# EAGLE design ISPACESLegacy2019 (EAGLE 9.2.2)
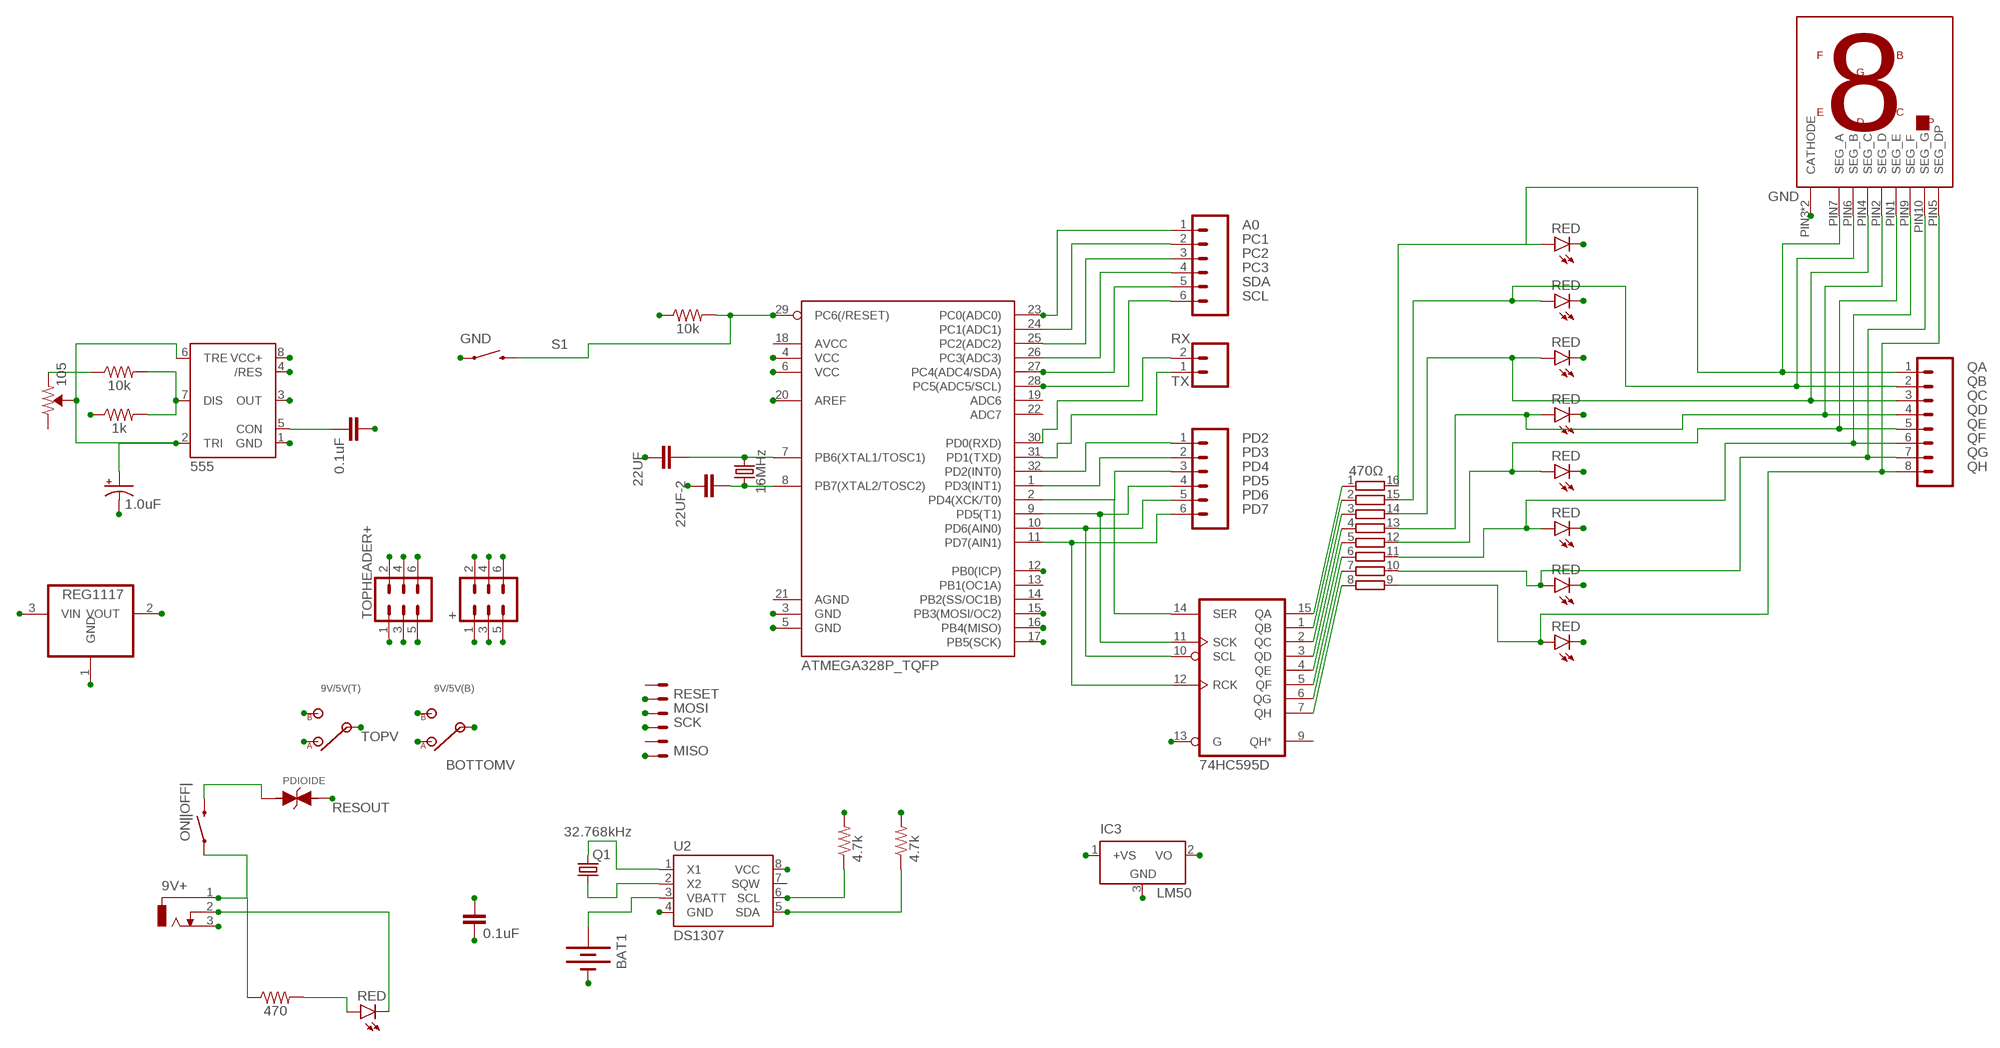
[diagram p0: schematic, sheet 1]

## Parts
9V+  DCJ0202  [DCJ0202]
9V/5V(B)  RES_SWITCH  [RES_SWITCH]
9V/5V(T)  RES_SWITCH  [RES_SWITCH]
22UF  22UF-1210-16V-20%  [1210]
22UF-2  22UF-1210-16V-20%  [1210]
470Ω  2NBS16-8  [SO16]
+  CONN_03X22X3_SILK_MALE_PTH  [2X3]
BAT1  BATTERY12PTH  [BATTCON_12MM_PTH]
C3  0.1uF  0.1UF-25V(+80/-20%)(0603)  [0603-CAP]
C4  0.1uF  0.1UF-0603-25V-(+80/-20%)  [0603]
C5  1.0uF  10UF-POLAR-EIA3216-16V-10%(TANT)  [EIA3216]
D1  RED  LED-RED1206  [LED-1206]
D2  RED  LED-RED1206  [LED-1206]
D3  RED  LED-RED1206  [LED-1206]
D4  RED  LED-RED1206  [LED-1206]
D5  RED  LED-RED1206  [LED-1206]
D6  RED  LED-RED1206  [LED-1206]
D7  RED  LED-RED1206  [LED-1206]
D8  RED  LED-RED1206  [LED-1206]
D10  RED  LED-RED1206  [LED-1206]
IC1  74HC595D  [SO16]
IC2  555  555D  [SO08]
IC3  LM50  [SOT23]
IC4  REG1117  [SOT223]
ISP  52745-0690  [52745-0690]
J1  CONN_08BM08B-SRSS-TB  [BM08B-SRSS-TB]
J2  CONN_02-JST-2MM-SMT  [JST-2-SMD]
J4  CONN_06SMD-FEMALE-V2  [1X06-SMD-FEMALE]
J5  CONN_06SMD-FEMALE-V2  [1X06-SMD-FEMALE]
ON||OFF|  RS032G05A3SM-SPST-MOMENTARY-SWSMD-1101NE  [TACTILE-SWITCH-1101NE]
PDIOIDE  WE-TVSP_BI_600W_824521201  [VARTVSP_SMB/DO-214AA]
Q1  32.768kHz  CRYSTAL32-SMD  [CRYSTAL-32KHZ-SMD]
R2  470  470OHM-0603-1/10W-1%  [0603]
R3  4.7k  4.7KOHM1/10W1%(0603)  [0603]
R4  4.7k  4.7KOHM1/10W1%(0603)  [0603]
R5  10k  10OHM-0603-1/10W-5%  [0603]
R6  1k  1KOHM-0603-1/10W-1%  [0603]
R7  10k  10OHM-0603-1/10W-1%  [0603]
S1  MOMENTARY-SWITCH-SPST-SMD-6.2MM-TALL  [TACTILE_SWITCH_SMD_6.2MM_TALL]
TOPHEADER+  CONN_03X22X3_SILK_MALE_PTH  [2X3]
U2  DS1307  DS1307SO8-TIGHT  [SO08-TIGHT]
U4  ATMEGA328P_TQFP  [TQFP32-08]
U$1  ACSC56SMT  [ACSC56]
VR1  105  TRIMPOT-SMD-3MM-CLOSED-1/8W-20%  [TRIMPOT-SMD-3MM-CLOSED]
Y1  16MHz  CRYSTAL-16MHZSMD-5X3.2  [CRYSTAL-SMD-5X3.2-4PAD]

## Nets
5V: 9V/5V(B).A 9V/5V(T).A C3.1 IC2.4(/RES) IC2.8(VCC+) IC3.1(+VS) IC4.2(VOUT) R3.2 R4.2 R5.1 R6.1 U2.8(VCC) U4.4(VCC) U4.6(VCC) U4.20(AREF)
A0: IC3.2(VO) J4.1 U4.23(PC0(ADC0))
BOTTOMV: 9V/5V(B).C(IN) +.2 +.4 +.6
GND: 9V+.2 9V+.3 22UF-2.2 22UF.2 +.1 +.3 +.5 BAT1.GND(-) C3.2 C4.1 C5.- D1.C D2.C D3.C D4.C D5.C D6.C D7.C D8.C D10.C IC1.13(G) IC2.1(GND) IC3.3(GND) IC4.1(GND) S1.A2 TOPHEADER+.1 TOPHEADER+.3 TOPHEADER+.5 U2.4(GND) U4.3(GND) U4.5(GND) U$1.PIN3(CATHODE) U$1.PIN8(CATHODE)
MISO: ISP.6 U4.16(PB4(MISO))
MOSI: ISP.3 U4.15(PB3(MOSI/OC2))
N$1: D10.A R2.2
N$2: 22UF.1 U4.7(PB6(XTAL1/TOSC1)) Y1.3
N$3: ON||OFF|.2 PDIOIDE.1
N$4: 22UF-2.1 U4.8(PB7(XTAL2/TOSC2)) Y1.1
N$5: IC2.7(DIS) R6.2 R7.2
N$6: C5.+ IC2.2(TRI) IC2.6(TRE) VR1.2(WIPER)
N$7: Q1.X2 U2.1(X1)
N$8: Q1.X1 U2.2(X2)
N$9: BAT1.VCC@1(+) U2.3(VBATT)
N$16: C4.2 IC2.5(CON)
N$17: 470Ω.1 IC1.15(QA)
N$18: 470Ω.2 IC1.1(QB)
N$19: 470Ω.3 IC1.2(QC)
N$20: 470Ω.4 IC1.3(QD)
N$21: 470Ω.5 IC1.4(QE)
N$22: 470Ω.6 IC1.5(QF)
N$23: 470Ω.7 IC1.6(QG)
N$24: 470Ω.8 IC1.7(QH)
N$39: R7.1 VR1.1(CCW)
PB0: IC2.3(OUT) U4.12(PB0(ICP))
PC1: J4.2 U4.24(PC1(ADC1))
PC2: J4.3 U4.25(PC2(ADC2))
PC3: J4.4 U4.26(PC3(ADC3))
PD2: J5.1 U4.32(PD2(INT0))
PD3: J5.2 U4.1(PD3(INT1))
PD4: IC1.14(SER) J5.3 U4.2(PD4(XCK/T0))
PD5: IC1.11(SCK) J5.4 U4.9(PD5(T1))
PD6: IC1.10(SCL) J5.5 U4.10(PD6(AIN0))
PD7: IC1.12(RCK) J5.6 U4.11(PD7(AIN1))
QA: 470Ω.16 D1.A J1.1 U$1.PIN7(SEG_A)
QB: 470Ω.15 D2.A J1.2 U$1.PIN6(SEG_B)
QC: 470Ω.14 D3.A J1.3 U$1.PIN4(SEG_C)
QD: 470Ω.13 D4.A J1.4 U$1.PIN2(SEG_D)
QE: 470Ω.12 D5.A J1.5 U$1.PIN1(SEG_E)
QF: 470Ω.11 D6.A J1.6 U$1.PIN9(SEG_F)
QG: 470Ω.10 D7.A J1.7 U$1.PIN10(SEG_G)
QH: 470Ω.9 D8.A J1.8 U$1.PIN5(SEG_DP)
RESET: ISP.2 R5.2 S1.B2 U4.29(PC6(/RESET))
RESOUT: 9V/5V(B).B 9V/5V(T).B IC4.3(VIN) PDIOIDE.2
RX: J2.2 U4.30(PD0(RXD))
SCK: ISP.4 U4.17(PB5(SCK))
SCL: J4.6 R3.1 U2.6(SCL) U4.28(PC5(ADC5/SCL))
SDA: J4.5 R4.1 U2.5(SDA) U4.27(PC4(ADC4/SDA))
TOPV: 9V/5V(T).C(IN) TOPHEADER+.2 TOPHEADER+.4 TOPHEADER+.6
TX: J2.1 U4.31(PD1(TXD))
UNRESOUT: 9V+.1 ON||OFF|.1 R2.1
Unconnected: IC1.9(QH*) ISP.1 ISP.5 U2.7(SQW) U4.13(PB1(OC1A)) U4.14(PB2(SS/OC1B)) U4.18(AVCC) U4.19(ADC6) U4.21(AGND) U4.22(ADC7) VR1.3(CW)

## Power pins joined to a net without a drawn wire
GND: IC1.8(GND)
VCC: IC1.16(VCC)

## Library data of the parts
9V+ = con-jack:DCJ0202: DC POWER JACK Source: DCJ0202.pdf; OC_FARNELL: unknown; OC_NEWARK: unknown
9V/5V(B) 9V/5V(T) = switches:RES_SWITCH: 0402 Static Resistor Selector
22UF 22UF-2 = SparkFun-Capacitors:22UF: 22µF ceramic capacitors A capacitor is a passive two-terminal electrical component used to store electrical energy temporarily in an electric field.
470Ω = resistor-bourns:2NBS16-8: BOURNS RESISTOR NETWORK; OC_FARNELL: unknown; OC_NEWARK: unknown
+ TOPHEADER+ = SparkFun-Connectors:CONN_03X2: Multi connection point. Often used as Generic Header-pin footprint for 0.1 inch spaced/style header connections You can populate with any combo of single row headers, but if you'd like an exact match, check these: Header - 2x3 (Male, 0.1") <https://www.sparkfun.com/products/12807> (PRT-12807) Header - 2x3 (Female, 0.1") <https://www.sparkfun.com/products/13010> (PRT-13010) 2x3 Pin Shrouded Header <https://www.sparkfun.com/products/10877> (PRT-10877) On any of the 0.1 inch spaced packages, you can populate with these: Break Away Headers - Straight <https://www.sparkfun.com/products/116> (PRT-00116) Break Away Male Headers - Right Angle <https://www.sparkfun.com/products/553> (PRT-00553) Female Headers <https://www.sparkfun.com/products/115> (PRT-00115) Break Away Headers - Machine Pin <https://www.sparkfun.com/products/117> (PRT-00117) Break Away Female Headers - Swiss Machine Pin <https://www.sparkfun.com/products/743> (PRT-00743) Special note: the shrouded connector mates well with our 3x2 ribbon cables: Ribbon Crimp Connector - 6-pin (2x3, Female) <https://www.sparkfun.com/products/10651> (PRT-10651) Ribbon Cable - 6 wire (15ft) <https://www.sparkfun.com/products/10646> (PRT-10646); PROD_ID: CONN-09701
BAT1 = SparkFun-Electromechanical:BATTERY: Battery Holders Various common sizes : AA, AAA, 20mm coin cell and 12mm coin cell. 20MM_4LEGS, BATT-10373
C3 = SparkFun-Capacitors:0.1UF-25V(+80/-20%)(0603): CAP-00810 Ceramic Standard decoupling cap; PROD_ID: CAP-00810
C4 = SparkFun-Capacitors:0.1UF: 0.1µF ceramic capacitors A capacitor is a passive two-terminal electrical component used to store electrical energy temporarily in an electric field.; PROD_ID: CAP-00810
C5 = SparkFun-Capacitors:10UF-POLAR: 10.0µF polarized capacitors A capacitor is a passive two-terminal electrical component used to store electrical energy temporarily in an electric field.; PROD_ID: CAP-00811; VALUE: 10uF
D1-D8 D10 = SparkFun-LED:LED-RED: Red SMD LED Used in manufacturing of most products at SparkFun Packages: 0603 - SMD 0603 package [Product Link] <http://docs.avagotech.com/docs/AV02-0551EN> 0603 SMART - SMD 0603 SMART package ( more efficient and expensive)[Product Link] <http://www.osram-os.com/Graphics/XPic2/00077099_0.pdf> 1206 - SMD1206 package [Product Link] <https://www.sparkfun.com/datasheets/DevTools/LilyPad/Q150OVS4.pdff> SparkFun Products: Pro Mini 328 -5V <https://www.sparkfun.com/products/821> RedBoard <https://www.sparkfun.com/products/12757> IOIO-OTG <https://www.sparkfun.com/products/13613>; PROD_ID: DIO-09912
IC1 = 74xx-eu:74*595: 8-bit SHIFT REGISTER, output latch
IC2 = SparkFun-IC-Special-Function:555: General purpose bipolar Timer Datasheet <http://www.sparkfun.com/datasheets/Components/General/ne555.pdf> SparkFun Products SparkFun SparkPunk Sequencer Kit <https://www.sparkfun.com/products/12707> (KIT-12707) Storefront Component: 555 Timer <https://www.sparkfun.com/products/9273> (COM-09273) Two parts valid for production: VFP: IC-11930 (M7555 PTH) VFP: IC-09173 (555 PTH) - Preferred; PROD_ID: NA-XXXXX
IC3 = linear:LM50: SOT-23 Single-Supply Centigrade Temperature Sensor Vout = (10mV/°C x Temp °C) +5mmmV Source: http://cache.national.com/ds/LM/LM50.pdf
IC4 = burr-brown:REG1117: 800mA and 1A Low Dropout (LDO) Positive Regulator 1.8V, 2.5V, 2.85V, 3.3V, 5V, and Adj; MPN: REG1117; OC_FARNELL: 1097566; OC_NEWARK: 14P6981
ISP = con-molex:52745-0690: FFC/FPC-to-Board 0.50mm (.020") SMT Top Contact Right Angle, ZIF, Style Receptacle 52745 / 52435 Source: http://www.molex.com/product/ffc/52745.html; MF: MOLEX; MPN: 52745-0690; OC_FARNELL: unknown; OC_NEWARK: 92M6374
J1 = SparkFun-Connectors:CONN_08: Multi connection point. Often used as Generic Header-pin footprint for 0.1 inch spaced/style header connections On any of the 0.1 inch spaced packages, you can populate with these: Break Away Headers - Straight <https://www.sparkfun.com/products/116> (PRT-00116) Break Away Male Headers - Right Angle <https://www.sparkfun.com/products/553> (PRT-00553) Female Headers <https://www.sparkfun.com/products/115> (PRT-00115) Break Away Headers - Machine Pin <https://www.sparkfun.com/products/117> (PRT-00117) Break Away Female Headers - Swiss Machine Pin <https://www.sparkfun.com/products/743> (PRT-00743) Arduino Stackable Header - 8 Pin <https://www.sparkfun.com/products/9279> (PRT-09279) For SCREWTERMINALS and SPRING TERMINALS visit here: Screw Terimnals on SparkFun.com <https://www.sparkfun.com/search/results?term=Screw+Terminals> (5mm/3.5mm/2.54mm spacing) This device is also useful as a general connection point to wire up your design to another part of your project. Our various solder wires solder well into these plated through hole pads. Hook-Up Wire - Assortment (Stranded, 22 AWG) <https://www.sparkfun.com/products/11375> (PRT-11375) Hook-Up Wire - Assortment (Solid Core, 22 AWG) <https://www.sparkfun.com/products/11367> (PRT-11367) View the entire wire category on our website here <https://www.sparkfun.com/categories/141> Special notes: Molex polarized connector foot print use with SKU : PRT-08231 with associated crimp pins and housings. 1MM SMD Version SKU: PRT-10208 NOTES ON THE VARIANTS LOCK and LOCK_LONGPADS... This footprint was designed to help hold the alignment of a through-hole component (i.e. 6-pin header) while soldering it into place. You may notice that each hole has been shifted either up or down by 0.005 of an inch from it's more standard position (which is a perfectly straight line). This slight alteration caused the pins (the squares in the middle) to touch the edges of the holes. Because they are alternating, it causes a "brace" to hold the component in place. 0.005 has proven to be the perfect amount of "off-center" position when using our standard breakaway headers. Although looks a little odd when you look at the bare footprint, once you have a header in there, the alteration is very hard to notice. Also,if you push a header all the way into place, it is covered up entirely on the bottom side.; PROD_ID: CONN-10556
J2 = SparkFun-Connectors:CONN_02: Multi connection point. Often used as Generic Header-pin footprint for 0.1 inch spaced/style header connections On any of the 0.1 inch spaced packages, you can populate with these: Break Away Headers - Straight <https://www.sparkfun.com/products/116> (PRT-00116) Break Away Male Headers - Right Angle <https://www.sparkfun.com/products/553> (PRT-00553) Female Headers <https://www.sparkfun.com/products/115> (PRT-00115) Break Away Headers - Machine Pin <https://www.sparkfun.com/products/117> (PRT-00117) Break Away Female Headers - Swiss Machine Pin <https://www.sparkfun.com/products/743> (PRT-00743) For SCREWTERMINALS and SPRING TERMINALS visit here: Screw Terimnals on SparkFun.com <https://www.sparkfun.com/search/results?term=Screw+Terminals> (5mm/3.5mm/2.54mm spacing) This device is also useful as a general connection point to wire up your design to another part of your project. Our various solder wires solder well into these plated through hole pads. Hook-Up Wire - Assortment (Stranded, 22 AWG) <https://www.sparkfun.com/products/11375> (PRT-11375) Hook-Up Wire - Assortment (Solid Core, 22 AWG) <https://www.sparkfun.com/products/11367> (PRT-11367) View the entire wire category on our website here <https://www.sparkfun.com/categories/141> Special notes: Molex polarized connector foot print use with: PRT-08233 with associated crimp pins and housings. 2.54_SCREWTERM for use with PRT-10571. 3.5mm Screw Terminal footprints for PRT-08084 5mm Screw Terminal footprints for use with PRT-08432; PROD_ID: CONN-11443
J4 J5 = SparkFun-Connectors:CONN_06: Multi connection point. Often used as Generic Header-pin footprint for 0.1 inch spaced/style header connections On any of the 0.1 inch spaced packages, you can populate with these: Break Away Headers - Straight <https://www.sparkfun.com/products/116> (PRT-00116) Break Away Male Headers - Right Angle <https://www.sparkfun.com/products/553> (PRT-00553) Female Headers <https://www.sparkfun.com/products/115> (PRT-00115) Break Away Headers - Machine Pin <https://www.sparkfun.com/products/117> (PRT-00117) Break Away Female Headers - Swiss Machine Pin <https://www.sparkfun.com/products/743> (PRT-00743) Arduino Stackable Header - 6 Pin <https://www.sparkfun.com/products/9280> (PRT-09280) For SCREWTERMINALS and SPRING TERMINALS visit here: Screw Terimnals on SparkFun.com <https://www.sparkfun.com/search/results?term=Screw+Terminals> (5mm/3.5mm/2.54mm spacing) This device is also useful as a general connection point to wire up your design to another part of your project. Our various solder wires solder well into these plated through hole pads. Hook-Up Wire - Assortment (Stranded, 22 AWG) <https://www.sparkfun.com/products/11375> (PRT-11375) Hook-Up Wire - Assortment (Solid Core, 22 AWG) <https://www.sparkfun.com/products/11367> (PRT-11367) View the entire wire category on our website here <https://www.sparkfun.com/categories/141>; PROD_ID: CONN-09668
ON||OFF| = BeagleBone_Blue_R3:RS032G05A3SM-SPST-MOMENTARY-SW: 6x3.5mm 2-pin Momentary Switch (Push-button) Digikey Link <https://www.digikey.com/products/en?keywords=CKN10388TR-ND> Datasheet <https://media.digikey.com/pdf/Data%20Sheets/C&K/RS-032G05_-SM_RT.pdf>; PROD_ID: SWCH-00815
PDIOIDE = Wurth_Elektronik_Passive_rev18f:WE-TVSP_BI_600W: WE-TVSP Power TVS Diode <http://katalog.we-online.de/media/images/v2/WE-TVSP_600W-3000W_D0214AA_4C.jpg> Details see: http://katalog.we-online.de/en/pbs/WE-TVSP/824500101 2015 (C) Würth Elektronik
Q1 = SparkFun-FreqCtrl:CRYSTAL: Various standard crystals. Proven footprints. Spark Fun Electronics SKU : COM-00534
R2 = SparkFun-Resistors:470OHM: 470Ω resistor A resistor is a passive two-terminal electrical component that implements electrical resistance as a circuit element. Resistors act to reduce current flow, and, at the same time, act to lower voltage levels within circuits. - Wikipedia; PROD_ID: RES-07869
R3 R4 = SparkFun-Resistors:4.7KOHM1/10W1%(0603): RES-07857; PROD_ID: RES-07857
R5 = SparkFun-Resistors:10OHM: 10Ω resistor A resistor is a passive two-terminal electrical component that implements electrical resistance as a circuit element. Resistors act to reduce current flow, and, at the same time, act to lower voltage levels within circuits. - Wikipedia; PROD_ID: RES-09834; VALUE: 10
R6 = SparkFun-Resistors:1KOHM: 1kΩ resistor A resistor is a passive two-terminal electrical component that implements electrical resistance as a circuit element. Resistors act to reduce current flow, and, at the same time, act to lower voltage levels within circuits. - Wikipedia; PROD_ID: RES-07856
R7 = SparkFun-Resistors:10OHM: 10Ω resistor A resistor is a passive two-terminal electrical component that implements electrical resistance as a circuit element. Resistors act to reduce current flow, and, at the same time, act to lower voltage levels within circuits. - Wikipedia; PROD_ID: RES-12581; VALUE: 10
S1 = SparkFun-Switches:MOMENTARY-SWITCH-SPST: Momentary Switch (Pushbutton) - SPST Normally-open (NO) SPST momentary switches (buttons, pushbuttons). Variants PTH-12MM - 12mm square, through-hole Momentary Pushbutton Switch - 12mm Square <https://www.sparkfun.com/products/9190> (COM-09190) PTH-6.0MM, PTH-6.0MM-KIT - 6.0mm square, through-hole Mini Pushbutton Switch <https://www.sparkfun.com/products/97> (COM-00097) KIT package intended for soldering kit's - only one side of pads' copper is exposed. PTH-RIGHT-ANGLE-KIT - Right-angle, through-hole Right Angle Tactile Button <https://www.sparkfun.com/products/10791> - Used on SparkFun BigTime Watch Kit <https://www.sparkfun.com/products/11734> SMD-12MM - 12mm square, surface-mount Tactile Button - SMD (12mm) <https://www.sparkfun.com/products/12993> (COM-12993) Used on SparkFun PicoBoard <https://www.sparkfun.com/products/11888> SMD-4.5MM - 4.5mm Square Trackball Switch Used on SparkFun Blackberry Trackballer Breakout <https://www.sparkfun.com/products/13169> SMD-4.6MMX2.8MM - 4.60mm x 2.80mm, surface mount Used on SparkFun SAMD21 Mini Breakout <https://www.sparkfun.com/products/13664> SMD-5.2MM, SMD-5.2-REDUNDANT - 5.2mm square, surface-mount Mini Pushbutton Switch - SMD <https://www.sparkfun.com/products/8720> (COM-08720) Used on Arduino Pro Mini <https://www.sparkfun.com/products/11114> REDUNDANT package connects both switch circuits together SMD-6.0X3.5MM - 6.0 x 3.5mm, surface mount Momentary Reset Switch SMD <https://www.sparkfun.com/products/8229> (COM-08229) SMD-6.2MM-TALL - 6.2mm square, surface mount Tactile Button - SMD (6mm) <https://www.sparkfun.com/products/12992> Used on SparkFun Digital Sandbox <https://www.sparkfun.com/products/12651> SMD-RIGHT-ANGLE - Right-angle, surface mount Used on SparkFun Block for Intel® Edison - Arduino <https://www.sparkfun.com/products/13036>; PROD_ID: SWCH-11966; SF_SKU: COM-12992
U2 = SparkFun-FreqCtrl:DS1307: I2C real-time clock with battery backup.
U4 = SparkFun-IC-Microcontroller:ATMEGA328P_TQFP: Popular 328P in QFP Storefront component: ATmega328 - TQFP <https://www.sparkfun.com/products/13448> (COM-13448) Datasheet <http://www.sparkfun.com/datasheets/Components/SMD/ATMega328.pdf> SparkFun Products SparkFun RedBoard - Programmed with Arduino <https://www.sparkfun.com/products/12757> (DEV-12757) Arduino Pro Mini 328 - 5V/16MHz <https://www.sparkfun.com/products/11113> (DEV-11113) Arduino Pro Mini 328 - 3.3V/8MHz <https://www.sparkfun.com/products/11114> (DEV-11114) SparkFun OpenLog <https://www.sparkfun.com/products/13712> (DEV-13712) SparkFun MicroView - OLED Arduino Module <https://www.sparkfun.com/products/12923> (DEV-12923) SparkFun Digital Sandbox <https://www.sparkfun.com/products/12651> (DEV-12651) SparkFun PicoBoard <https://www.sparkfun.com/products/11888> (WIG-11888) Arduino Fio <https://www.sparkfun.com/products/10116> (DEV-10116) LilyPad Arduino 328 Main Board <https://www.sparkfun.com/products/13342> (DEV-13342) SparkFun RedStick <https://www.sparkfun.com/products/13741> (DEV-13741) LilyPad MP3 <https://www.sparkfun.com/products/11013> (DEV-11013) LilyPad Arduino SimpleSnap <https://www.sparkfun.com/products/10941> (DEV-10941) SparkFun Stepoko <https://www.sparkfun.com/products/13899> (ROB-13899) SparkFun Geiger Counter <https://www.sparkfun.com/products/11345> (SEN-11345) SparkFun EL Sequencer <https://www.sparkfun.com/products/12781> (COM-12781) Arduino Pro 328 - 5V/16MHz <https://www.sparkfun.com/products/10915> (DEV-10915) CryptoCape <https://www.sparkfun.com/products/12773> (DEV-12773) SparkFun IR Thermometer Evaluation Board - MLX90614 <https://www.sparkfun.com/products/10740> (SEN-10740) SparkFun RedBot Mainboard <https://www.sparkfun.com/products/12097> (ROB-12097) Arduino Pro 328 - 3.3V/8MHz <https://www.sparkfun.com/products/10914> (DEV-10914) SparkFun Block for Intel® Edison - Arduino <https://www.sparkfun.com/products/13036> (DEV-13036) SparkFun Simon Says - Surface Mount Soldering Kit <https://www.sparkfun.com/products/10935> (KIT-10935) SparkFun 7-Segment Serial Display - Red <https://www.sparkfun.com/products/11441> (COM-11441) SparkFun 7-Segment Serial Display - White <https://www.sparkfun.com/products/11629> (COM-11629) SparkFun 7-Segment Serial Display - Yellow <https://www.sparkfun.com/products/11443> (COM-11443) SparkFun 7-Segment Serial Display - Kelly Green <https://www.sparkfun.com/products/11440> (COM-11440) SparkFun 7-Segment Serial Display - Blue <https://www.sparkfun.com/products/11442> (COM-11442) SparkFun OpenSegment Serial Display - 20mm (Blue) <https://www.sparkfun.com/products/11647> (COM-11647) SparkFun OpenSegment Serial Display - 20mm (Green) <https://www.sparkfun.com/products/11646> (COM-11646) SparkFun OpenSegment Serial Display - 20mm (White) <https://www.sparkfun.com/products/11648> (COM-11648) SparkFun OpenSegment Serial Display - 20mm (Red) <https://www.sparkfun.com/products/11644> (COM-11644) SparkFun OpenSegment Serial Display - 20mm (Yellow) <https://www.sparkfun.com/products/11645> (COM-11645) SparkFun OpenSegment Shield <https://www.sparkfun.com/products/13190> (DEV-13190); PROD_ID: IC-09069
U$1 = Feesta-parts:ACSC56
VR1 = SparkFun-Resistors:TRIMPOT: Trimming Potentiometer (Trimpot) Three-terminal potentiometers, with an adjustable wiper and two adjustable resistors. A pot can be used to create a configurable voltage divider, or as a variable resistor. "Trimpots" are a subset of potentiometers, usually intended for "set-and-forget" applications. They're often more delicate than standard potentiometers - rated for fewer turns. Variants PTH-KNOB - PTH Trimpot w/ finger-adjustable knob Trimpot 10K with Knob <https://www.sparkfun.com/products/9806> (COM-09806) Datasheet <http://www.sparkfun.com/datasheets/Components/General/TSR-3386.pdf> SMD-3MM-CLOSED-FRAME - SMD 3mm Square Closed-Frame Trimpot Used on e.g. EasyDriver - Stepper Motor Driver <https://www.sparkfun.com/products/12779> Datasheet <http://www.bitechnologies.com/pdfs/22.pdf> (22AR10KTR) SMD-5MM - SMD 5mm Square Closed-Frame Trimpot Used on e.g. IOIO-OTG - V2.2 <https://www.sparkfun.com/products/13613> Datasheet <http://www.vishay.com/docs/51008/ts53.pdf> (TS53YL502MR10) SMD-3MM-1/10W-25% - 3mm Square Open-Frame Trimpot Used on e.g. SparkFun Shapeoko <https://www.sparkfun.com/products/13899> Datasheet <http://www.bourns.com/docs/Product-Datasheets/TC33.pdf> (TC33X-2-103E); PROD_ID: RES-09285; VALUE: 10k
Y1 = SparkFun-Clocks:CRYSTAL-16MHZ: 16MHz Crystal Digikey Example <http://www.digikey.com/product-search/en?keywords=535-9122-1-ND> Frequency: 16MHz Frequency Stability: ±50ppm Frequency Tolerance: ±20ppm Load Capacitance: 18pF SparkFun Products: Pro Micro -5V/16MHz <https://www.sparkfun.com/products/12640> SparkFun Serial Enabled LCD Kit <https://www.sparkfun.com/products/10097>; PROD_ID: XTAL-08218; SF_ID: COM-00094

## Board
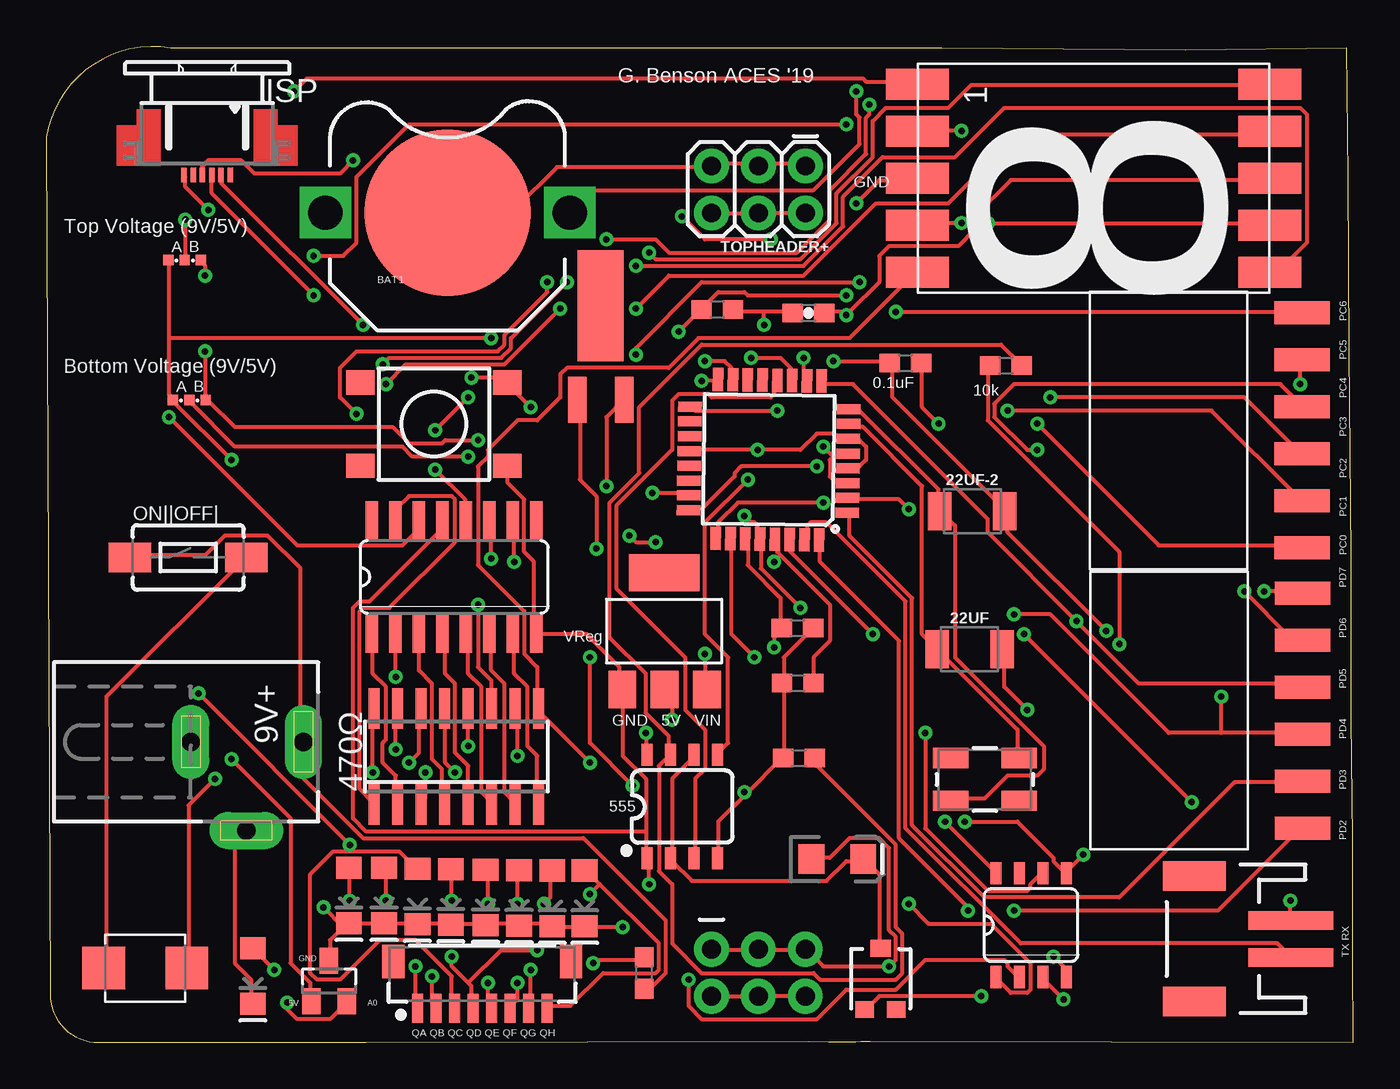
[diagram p1: board, top side]
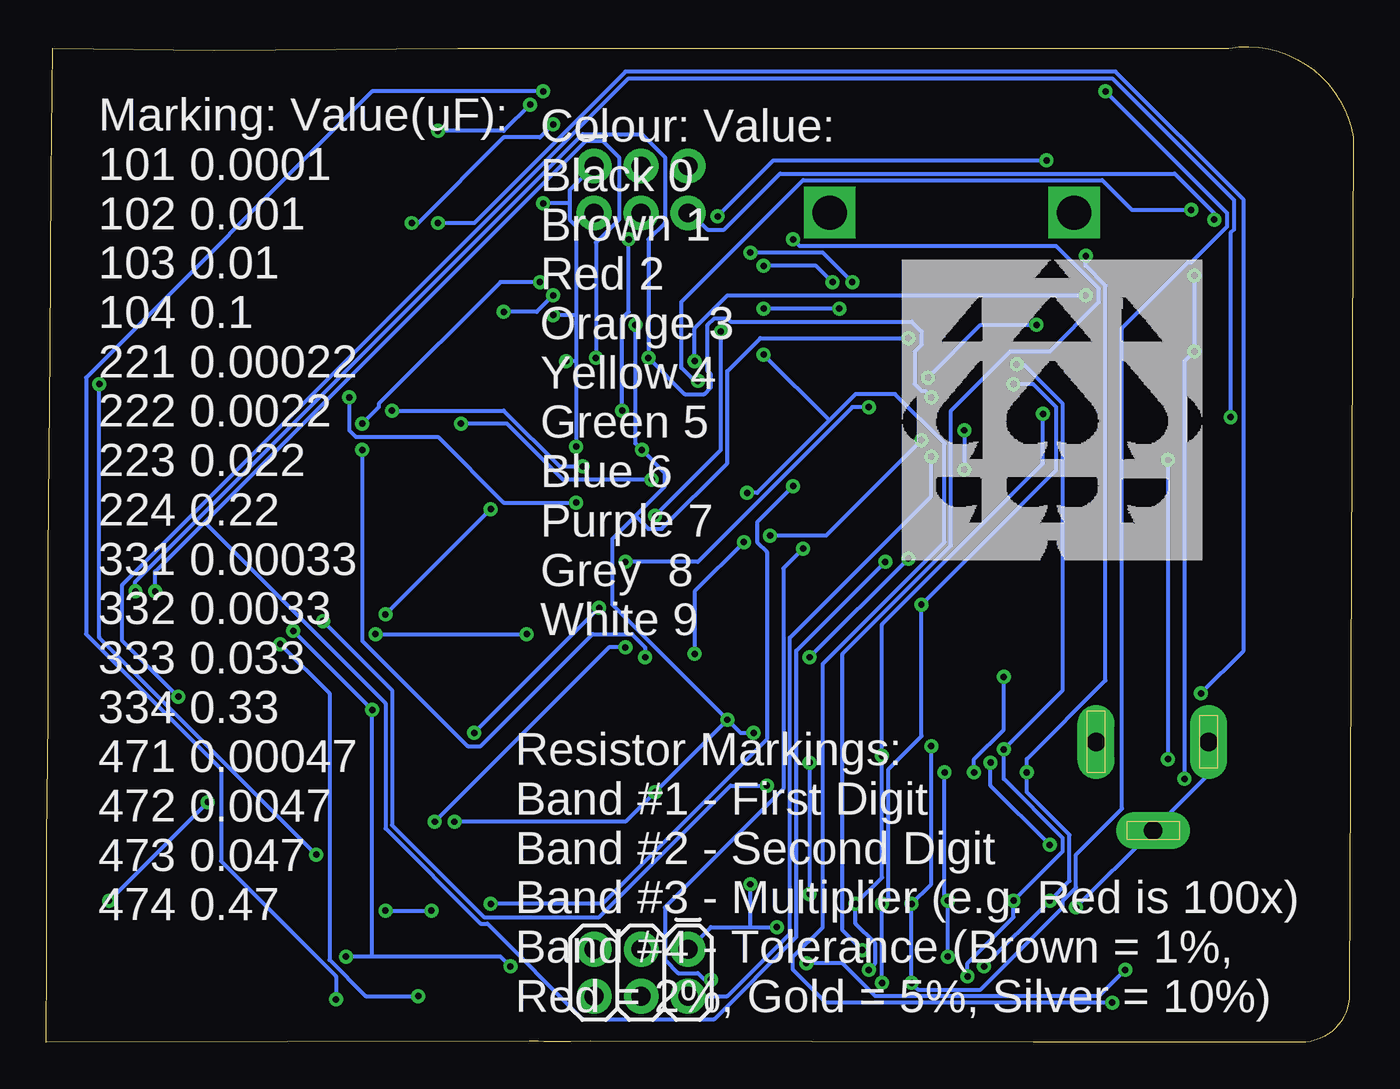
[diagram p2: board, bottom side, seen from below]

Size 70.66 x 53.82 mm. Coordinates in mm from the lower left corner, seen from the top.
Outline: 44.07,0.06 44.19,0.06 44.21,0.06 44.25,0.06 44.3,0.06 44.39,0.06 44.51,0.06 44.54,0.06 44.55,0.06 44.56,0.06 70.66,0.02 70.63,4.49 70.63,10.98 70.56,17.5 70.56,26.34 70.46,37.33 70.39,46.76 70.33,53.74 61.58,53.63 48.41,53.74 6.73,53.74 arc90 0,48.91 0.21,2.61 arc90 2.83,0 14.22,0 14.84,0.01 15.49,0.01 17.31,0.01 41.23,0.06 42.32,0.05 43.79,0.05 44.05,0.05 44.07,0.06
Copper layers (1*16): Top 0.035mm / dielectric 1.5mm / Bottom 0.035mm
Design rules "default *": minimum track width 8mil, minimum drill 0.35mm, track to track 6mil, track to pad 6mil, pad to pad 6mil, via to via 6mil, smd to smd 6mil, copper to edge 40mil, drill to drill 6mil, minimum pad ring 10mil, minimum via ring 8mil, stop-mask expansion 4mil, vias tented up to drill 0mil, thermal gap 10mil

### Footprints (pad centres in the part's own frame; a part is rotated, then mirrored left to right if it is on the bottom)
DCJ0202 = drill 1 pad 2 long: 1 0,3.1; 2 4.8,0; 3 0,-3
RES_SWITCH = smd 0.56 x 0.56: A -0.88,0; B 0.88,0; C 0,0
1210 = smd 1.27 x 2.06: 1 -1.755,0; 2 1.755,0
SO16 = smd 0.6 x 2.2: 1 -4.445,-2.6; 2 -3.175,-2.6; 3 -1.905,-2.6; 4 -0.635,-2.6; 5 0.635,-2.6; 6 1.905,-2.6; 7 3.175,-2.6; 8 4.445,-2.6; 9 4.445,2.6; 10 3.175,2.6; 11 1.905,2.6; 12 0.635,2.6; 13 -0.635,2.6; 14 -1.905,2.6; 15 -3.175,2.6; 16 -4.445,2.6
2X3 = drill 1.016 pad 1.88: 1 0,0; 2 0,2.54; 3 2.54,0; 4 2.54,2.54; 5 5.08,0; 6 5.08,2.54
BATTCON_12MM_PTH = smd 9 x 9: GND 0,0 | drill 1.854 square: VCC@1 6.604,0; VCC@2 -6.604,0
0603-CAP = smd 1.1 x 1: 1 -0.85,0; 2 0.85,0
0603 = smd 1.1 x 1: 1 -0.85,0; 2 0.85,0
EIA3216 = smd 1.4 x 1.6: + 1.4,0; - -1.4,0
LED-1206 = smd 1.2 x 1.4: A -1.5,0; C 1.5,0
SO16' = smd 0.66 x 2.032: 1 -4.445,-3.073; 2 -3.175,-3.073; 3 -1.905,-3.073; 4 -0.635,-3.073; 5 0.635,-3.073; 6 1.905,-3.073; 7 3.175,-3.073; 8 4.445,-3.073; 9 4.445,3.073; 10 3.175,3.073; 11 1.905,3.073; 12 0.635,3.073; 13 -0.635,3.073; 14 -1.905,3.073; 15 -3.175,3.073; 16 -4.445,3.073
SO08 = smd 0.6 x 1.2: 1 -1.905,-2.8; 2 -0.635,-2.8; 3 0.635,-2.8; 4 1.905,-2.8; 5 1.905,2.8; 6 0.635,2.8; 7 -0.635,2.8; 8 -1.905,2.8
SOT23 = smd 1 x 1.4: 1 -0.95,-1.1; 2 0.95,-1.1; 3 0,1.1
SOT223 = smd 1.499 x 2.007: 1 -2.261,-3.15; 2 0.025,-3.15; 3 2.311,-3.15 | smd 3.81 x 2.007: 4 0,3.15
52745-0690 = smd 0.3 x 0.8: 1 -1.25,2.5; 2 -0.75,2.5; 3 -0.25,2.5; 4 0.25,2.5; 5 0.75,2.5; 6 1.25,2.5
BM08B-SRSS-TB = smd 0.6 x 1.55: 1 -3.5,0; 2 -2.5,0; 3 -1.5,0; 4 -0.5,0; 5 0.5,0; 6 1.5,0; 7 2.5,0; 8 3.5,0 | smd 1.2 x 1.8: P$9 4.8,2.525; P$10 -4.8,2.525
JST-2-SMD = smd 1 x 4.6: 1 -1,-3.7; 2 1,-3.7 | smd 1.6 x 3.4: NC1 -3.4,1.5; NC2 3.4,1.5
1X06-SMD-FEMALE = smd 1.25 x 3: 1 6.35,3.425; 2 3.81,3.425; 3 1.27,3.425; 4 -1.27,3.425; 5 -3.81,3.425; 6 -6.35,3.425
TACTILE-SWITCH-1101NE = smd 2.3 x 1.6: 1 -3.15,0; 2 3.15,0
VARTVSP_SMB/DO-214AA = smd 2.3 x 2.3: 1 -2.25,0; 2 2.25,0
CRYSTAL-32KHZ-SMD = smd 2.5 x 6: SHEILD 0,5.08 | smd 1 x 2.5: X1 -1.27,0; X2 1.27,0
TACTILE_SWITCH_SMD_6.2MM_TALL = smd 1.55 x 1.3: A1 -3.975,-2.25; A2 3.975,-2.25; B1 -3.975,2.25; B2 3.975,2.25
SO08-TIGHT = smd 0.6 x 1.2: 1 -1.905,-2.8; 2 -0.635,-2.8; 3 0.635,-2.8; 4 1.905,-2.8; 5 1.905,2.8; 6 0.635,2.8; 7 -0.635,2.8; 8 -1.905,2.8
TQFP32-08 = smd 1.27 x 0.559: 1 -4.293,2.8; 2 -4.293,2; 3 -4.293,1.2; 4 -4.293,0.4; 5 -4.293,-0.4; 6 -4.293,-1.2; 7 -4.293,-2; 8 -4.293,-2.8; 17 4.293,-2.8; 18 4.293,-2; 19 4.293,-1.2; 20 4.293,-0.4; 21 4.293,0.4; 22 4.293,1.2; 23 4.293,2; 24 4.293,2.8 | smd 0.559 x 1.27: 9 -2.8,-4.293; 10 -2,-4.293; 11 -1.2,-4.293; 12 -0.4,-4.293; 13 0.4,-4.293; 14 1.2,-4.293; 15 2,-4.293; 16 2.8,-4.293; 25 2.8,4.293; 26 2,4.293; 27 1.2,4.293; 28 0.4,4.293; 29 -0.4,4.293; 30 -1.2,4.293; 31 -2,4.293; 32 -2.8,4.293
ACSC56 = smd 1.7 x 3.4: PIN1 -5.08,-9.525; PIN2 -2.54,-9.525; PIN3 0,-9.525; PIN4 2.54,-9.525; PIN5 5.08,-9.525; PIN6 5.08,9.525; PIN7 2.54,9.525; PIN8 0,9.525; PIN9 -2.54,9.525; PIN10 -5.08,9.525
TRIMPOT-SMD-3MM-CLOSED = smd 1 x 0.9: 1 -0.85,-1.65; 3 0.85,-1.65 | smd 1.1 x 0.9: 2 0,1.65
CRYSTAL-SMD-5X3.2-4PAD = smd 1.9 x 1.1: 1 -1.85,-1.15; 2 1.85,-1.15; 3 1.85,1.15; 4 -1.85,1.15

### Placement (x,y rotation side)
9V+  10.81,16.25 270 top
9V/5V(B)  7.74,34.73 0 top
9V/5V(T)  7.48,42.28 0 top
22UF  49.91,21.24 0 top
22UF-2  50.06,28.71 0 top
470Ω  22.17,15.46 0 top
+  35.96,5.03 180 bottom
BAT1  21.7,44.85 0 top
C3  41.21,39.43 0 top
C4  46.46,36.71 0 top
C5  42.77,9.91 0 top
D1  16.36,7.94 270 top
D2  18.27,7.94 270 top
D3  20.07,7.89 270 top
D4  21.87,7.87 270 top
D5  23.75,7.84 270 top
D6  25.56,7.81 270 top
D7  27.36,7.79 270 top
D8  29.11,7.79 270 top
D10  11.17,3.59 270 top
IC1  74HC595D  [SO16']  22.05,25.16 0 top
IC2  34.38,12.75 0 top
IC3  15.29,3.32 0 top
IC4  33.41,22.23 0 top
ISP  8.7,49.38 180 top
J1  23.57,1.85 0 top
J2  63.58,5.61 90 top
J4  64.48,33.08 270 top
J5  64.51,17.94 270 top
ON||OFF|  7.68,26.22 0 top
PDIOIDE  5.36,4.02 0 top
Q1  29.97,34.74 0 top
R2  32.35,3.76 90 top
R3  36.28,39.63 0 top
R4  40.62,22.39 0 top
R5  40.63,19.42 0 top
R6  40.69,15.37 0 top
R7  51.88,36.58 0 top
S1  20.96,33.42 0 top
TOPHEADER+  41.05,47.37 180 top
U2  53.24,6.34 0 top
U4  39.06,31.5 179.1 top
U$1  56.62,46.71 270 top
VR1  45.11,3.44 0 top
Y1  50.75,14.22 0 top

### Tracks (layer width: path | path; a pad name or v marks a point on that pad's centre or on a via)
5V  (via drill 0.35)
  Top 0.203: 6.63,38.07 6.63,35.04 6.81,34.87 9V/5V(B).A 6.81,34.69 v10.01,31.49 | 6.63,38.07 6.63,42.16 9V/5V(T).A | v10.01,15.31 13.21,12.11 13.21,4.28 14.28,3.22 14.28,2.33 IC3.1 | R4.2 41.31,22.24 39.88,20.82 39.88,19.57 R5.1 39.88,19.4 39.88,15.49 R6.1 39.7,15.31 37.93,13.53 | 37.93,13.53 36.33,11.93 36.33,9.97 IC2.4 | U4.20 34.9,32.02 v38.46,32.02 40.77,32.02 41.66,32.91 42.55,32.91 42.73,32.73 43.26,32.73 U4.6 43.44,32.55 43.97,32.55 44.33,32.2 44.33,31.49 43.97,31.13 43.44,31.13 U4.4 | 38.82,39.49 40.24,39.49 C3.1 | 38.82,39.49 37.22,39.49 R3.2 | v32.42,16.73 32.42,15.66 IC2.8 | v33.84,17.44 33.84,18.69 33.48,19.04 IC4.2 | v48.59,11.93 51.26,9.26 U2.8 | v38.82,38.78 38.82,39.49 | v37.75,13.53 37.93,13.53 | v24.06,38.07 6.63,38.07
  Bottom 0.203: v10.01,31.49 v10.01,15.31 | v32.42,16.73 33.13,16.73 v33.84,17.44 | v48.59,11.93 39.35,11.93 v37.75,13.53 v33.84,17.44 | v38.82,38.78 38.82,32.38 v38.46,32.02 37.22,30.78 37.22,30.07 38.82,28.46 | 38.82,28.46 40.06,27.22 40.06,23.66 v33.84,17.44 | v24.06,38.07 32.06,38.07 33.84,36.29 33.84,31.31 37.39,27.75 38.1,27.75 38.82,28.46
A0  (via drill 0.35)
  Top 0.203: v32.77,29.71 34.73,29.71 U4.23 | v13.03,2.15 13.03,1.79 13.57,1.26 15.35,1.26 16.24,2.15 IC3.2 | v53.57,33.44 60.15,26.86 67.8,26.86 J4.1 | v43.97,41.09 35.44,41.09 31.88,37.53 v31.88,37.18
  Bottom 0.203: v32.77,29.71 32.24,29.71 28.33,33.62 | 28.33,33.62 26.9,35.04 24.77,35.04 22.1,32.38 22.1,27.04 28.68,20.46 28.68,6.24 30.28,4.64 30.28,3.93 28.5,2.15 v13.03,2.15 | v53.57,33.44 52.68,34.33 52.68,34.51 46.11,41.09 v43.97,41.09 | 28.33,33.62 v31.88,37.18
BOTTOMV  (via drill 0.35)
  Top 0.203: +.6 40.95,2.51 38.64,2.51 +.4 38.46,2.51 35.97,2.51 +.2 | v22.81,31.67 19.79,31.67 19.26,32.2 10.19,32.2 7.88,34.51 7.88,34.69 9V/5V(B).C
  Bottom 0.203: v22.81,31.67 22.81,29.53 30.46,21.89 30.46,5.88 33.84,2.51 35.79,2.51 +.2
GND  (via drill 0.35)
  Top 0.203: 43.26,39.49 43.44,39.49 45.04,41.09 45.04,42.51 45.57,43.04 49.31,43.04 50.2,43.93 50.2,44.64 52.15,46.6 66.02,46.6 U$1.PIN8 | 43.26,39.49 42.19,39.49 C3.2 | 42.55,31.67 42.37,31.49 42.37,30.6 42.73,30.24 43.26,30.24 U4.3 | 42.55,31.67 43.26,31.67 U4.5 | v42.02,32.2 42.55,31.67 | v43.79,45.36 45.04,46.6 46.99,46.6 U$1.PIN3 | TOPHEADER+.1 40.95,47.49 38.64,47.49 TOPHEADER+.3 38.46,47.49 35.97,47.49 TOPHEADER+.5 35.79,47.31 27.61,47.31 25.3,45 21.75,45 BAT1.GND | v42.55,36.82 45.57,36.82 C4.1 45.75,36.64 45.75,34.87 51.8,28.82 22UF-2.2 51.97,28.64 51.97,27.58 v57.31,22.24 | v43.26,39.31 43.26,39.49 | S1.A2 24.95,31.13 24.95,30.24 25.84,29.35 25.84,26.51 26.37,25.98 26.37,22.24 IC1.8 26.55,22.06 29.21,22.06 30.99,20.29 30.99,19.22 IC4.1 31.17,19.04 31.17,15.49 32.42,14.24 32.42,11.4 | 32.42,11.4 32.42,9.97 IC2.1 32.59,9.8 v32.59,8.55 | 32.42,11.4 17.3,11.4 16.59,12.11 16.59,23.49 16.95,23.84 17.48,23.84 21.39,27.75 21.39,28.11 IC1.13 | D10.C 11.08,2.15 11.08,3.4 10.19,4.28 10.19,10.86 10.72,11.4 9V+.2 | 16.06,6.24 16.24,6.42 D1.C | 16.06,6.24 15.35,5.53 15.35,4.46 IC3.3 | D1.C 16.41,6.42 18.19,6.42 D2.C 18.37,6.42 19.97,6.42 D3.C 20.15,6.42 21.75,6.42 D4.C 21.92,6.42 23.7,6.42 D5.C 23.88,6.42 25.48,6.42 D6.C 25.66,6.42 27.26,6.42 D7.C 27.44,6.24 29.04,6.24 D8.C 29.21,6.24 v31.17,6.24 | +.1 35.97,5 38.46,5 +.3 38.64,5 40.95,5 +.5 41.13,5 42.02,4.11 v45.57,4.11 45.93,4.46 45.93,5.71 45.57,6.06 45.57,10.51 45.04,11.04 43.44,11.04 42.37,9.97 41.48,9.97 C5.- | v54.46,4.64 55,4.11 55,3.57 U2.4 | v53.04,17.97 51.8,19.22 51.8,21.18 22UF.2 | 16.06,6.24 v14.99,7.31
  Top 0.203: 16.06,6.24 D1.C
  Bottom 0.203: 42.02,39.31 42.02,44.11 42.37,44.47 42.37,45.36 | 42.02,39.31 42.02,36.82 | 42.02,36.82 v42.02,32.2 | 42.37,45.36 42.37,46.07 41.13,47.31 TOPHEADER+.1 | 42.37,45.36 v43.79,45.36 | 42.02,36.82 v42.55,36.82 | 42.02,39.31 v43.26,39.31 | 9V+.3 7.88,16.2 7.88,14.42 10.72,11.57 9V+.2 10.9,11.4 v14.99,7.31 | 53.04,4.64 46.11,4.64 v45.57,4.11 | 53.04,4.64 v54.46,4.64 | 53.04,4.64 v53.04,17.97 v57.31,22.24 | 32.59,6.24 34.73,6.24 35.79,5.17 +.1 | 32.59,6.24 v31.17,6.24 | 32.59,6.24 v32.59,8.55
MISO  (via drill 0.35)
  Top 0.203: v8.77,45 7.52,46.24 7.52,46.78 ISP.6 | v35.44,35.75 36.15,35.75 U4.16
  Bottom 0.203: v8.77,45 11.97,45 13.57,46.6 29.75,46.6 36.33,40.02 36.33,36.47 35.62,35.75 v35.44,35.75
MOSI  (via drill 0.35)
  Top 0.203: v14.46,40.38 8.95,45.89 8.95,46.78 ISP.3 | v35.62,36.82 36.68,36.82 37.04,36.47 37.04,35.93 U4.15
  Bottom 0.203: v14.46,40.38 33.84,40.38 35.62,38.6 v35.62,36.82
N$1  (via drill 0.35)
  Top 0.203: v29.57,4.28 29.75,4.46 32.24,4.46 R2.2 | v12.32,3.93 11.26,5 D10.A
  Bottom 0.203: v29.57,4.28 27.61,4.28 25.84,2.51 13.75,2.51 v12.32,3.93
N$2
  Top 0.203: U4.7 43.44,33.27 44.15,33.27 47.35,30.07 47.35,22.06 48.06,21.35 22UF.1 48.24,21.18 52.51,16.91 52.51,15.49 Y1.3
N$3
  Top 0.203: PDIOIDE.1 3.26,4.11 3.26,18.69 10.72,26.15 ON||OFF|.2
N$4
  Top 0.203: U4.8 43.44,34.15 43.97,34.15 48.24,29.89 48.24,28.82 22UF-2.1 48.42,28.64 49.13,27.93 49.13,20.82 53.93,16.02 53.93,14.77 53.57,14.42 51.97,14.42 50.73,13.17 48.95,13.17 Y1.1
N$5
  Top 0.203: R6.2 41.66,15.31 41.66,14.95 45.93,10.68 45.93,6.24 46.28,5.88 46.28,3.75 45.93,3.4 41.84,3.4 41.48,3.75 35.44,3.75 33.84,5.35 33.84,8.55 33.13,9.26 33.13,14.95 33.66,15.49 IC2.7 33.66,15.66 33.66,16.55 32.42,17.8 32.42,19.93 30.46,21.89 30.46,29.18 32.06,30.78 32.06,34.33 35.44,37.71 51.62,37.71 52.68,36.64 R7.2
N$6
  Top 0.203: VR1.2 45.04,5.17 45.04,9.08 44.33,9.8 C5.+ 44.15,9.8 43.26,9.8 42.19,8.73 34.9,8.73 33.84,9.8 IC2.2 33.84,9.97 33.84,14.24 35.08,15.49 IC2.6
N$7  (via drill 0.35)
  Top 0.203: v46.64,7.48 47.71,6.42 51.08,6.42 53.22,4.28 53.22,2.86 53.04,2.68 52.15,2.68 51.44,3.4 U2.1 | v30.28,30.07 30.28,33.8 31.17,34.69 Q1.X2
  Bottom 0.203: v46.64,7.48 40.59,7.48 31.7,16.37 31.7,26.51 32.24,27.04 32.24,28.11 v30.28,30.07
N$8  (via drill 0.35)
  Top 0.203: v34.73,3.4 34.73,1.97 35.44,1.26 41.66,1.26 43.26,2.86 45.93,2.86 47.53,4.46 51.8,4.46 51.97,4.28 51.97,4.11 52.51,3.57 U2.2 | v29.75,26.69 29.75,29.53 28.86,30.42 28.86,34.69 Q1.X1
  Bottom 0.203: v34.73,3.4 35.08,3.4 35.44,3.75 36.5,3.75 37.22,4.46 37.22,7.31 30.81,13.71 30.81,25.62 v29.75,26.69
N$9  (via drill 0.35)
  Top 0.203: v55,2.33 53.93,3.4 U2.3 | v43.79,51.4 43.79,50.16 43.97,49.98 43.97,48.56 41.48,46.07 29.39,46.07 28.33,45 BAT1.VCC@1
  Bottom 0.203: v55,2.33 55,3.57 61.22,9.8 61.22,14.77 68.51,22.06 68.51,35.93 53.04,51.4 v43.79,51.4
N$16  (via drill 0.35)
  Top 0.203: v48.24,33.44 47.35,34.33 47.35,36.64 C4.2 | v37.93,30.42 35.62,28.11 35.62,22.06 36.86,20.82 36.86,16.2 36.33,15.66 IC2.5
  Bottom 0.203: v48.24,33.44 45.75,33.44 42.73,30.42 v37.93,30.42
N$17
  Top 0.203: IC1.15 18.9,28.29 18.9,28.82 19.61,29.53 21.92,29.53 22.1,29.35 22.1,27.04 18.55,23.49 17.12,23.49 16.95,23.31 16.95,13.71 17.66,13 470Ω.1
N$18
  Top 0.203: IC1.1 17.66,22.06 17.66,19.93 18.37,19.22 18.37,16.37 18.19,16.2 18.19,15.13 18.9,14.42 18.9,13 470Ω.2
N$19  (via drill 0.35)
  Top 0.203: v18.9,19.75 18.9,22.06 IC1.2 | v20.5,14.6 20.5,13.17 20.32,13 470Ω.3
  Bottom 0.203: v18.9,19.75 18.9,16.91 20.5,15.31 v20.5,14.6
N$20
  Top 0.203: IC1.3 20.15,20.11 20.86,19.4 20.86,15.31 21.39,14.77 21.39,13 470Ω.4
N$21
  Top 0.203: IC1.4 21.57,22.06 21.57,19.93 22.1,19.4 22.1,15.66 22.81,14.95 22.81,13 470Ω.5
N$22
  Top 0.203: IC1.5 22.81,22.06 22.81,19.93 23.53,19.22 23.53,13.53 24.06,13 470Ω.6
N$23
  Top 0.203: IC1.6 24.06,22.06 24.06,20.11 24.77,19.4 24.77,13.53 25.3,13 470Ω.7
N$24
  Top 0.203: IC1.7 25.3,22.06 25.3,19.93 26.01,19.22 26.01,16.02 26.55,15.49 26.55,13 470Ω.8
N$39  (via drill 0.35)
  Top 0.203: v50.55,2.51 45.04,2.51 44.33,1.79 VR1.1 | v58.02,21.53 58.02,26.51 50.91,33.62 50.91,36.47 R7.1
  Bottom 0.203: v50.55,2.51 53.4,2.51 55.35,4.46 55.35,18.86 v58.02,21.53
PB0
  Top 0.203: IC2.3 35.08,9.97 35.08,14.24 35.62,14.77 35.62,16.91 34.55,17.97 34.55,20.82 30.81,24.55 30.81,29 33.84,32.02 33.84,34.69 34.19,35.04 35.79,35.04 35.97,34.87 39.17,34.87 39.35,35.04 39.35,35.75 U4.12
PC1  (via drill 0.35)
  Top 0.203: v41.66,31.13 37.57,31.13 37.22,30.78 37.22,30.6 35.44,28.82 34.73,28.82 U4.24 | v51.97,34.15 63,34.15 67.8,29.35 J4.2
  Bottom 0.203: v41.66,31.13 42.91,31.13 45.93,34.15 v51.97,34.15
PC2  (via drill 0.35)
  Top 0.203: v42.02,29.18 37.39,29.18 36.33,28.11 36.33,27.4 U4.25 | v54.28,34.87 64.77,34.87 67.8,31.84 J4.3
  Bottom 0.203: v42.02,29.18 45.93,29.18 49.48,32.73 53.93,32.73 54.28,33.09 v54.28,34.87
PC3  (via drill 0.35)
  Top 0.203: v38.28,20.82 37.04,22.06 37.04,27.22 U4.26 | v53.57,32.02 53.04,32.02 51.26,33.8 51.26,34.51 52.33,35.58 66.73,35.58 67.8,34.51 J4.4
  Bottom 0.203: v38.28,20.82 38.28,21.35 38.99,22.06 41.13,22.06 47.17,16.02 47.88,16.02 53.57,21.71 v53.57,32.02
PD2  (via drill 0.35)
  Top 0.203: v49.84,7.13 49.84,7.31 46.11,11.04 46.11,21.71 41.84,25.98 41.84,27.04 U4.32 | v52.33,7.13 63.35,7.13 67.8,11.57 J5.1
  Bottom 0.203: v52.33,7.13 v49.84,7.13
PD3
  Top 0.203: U4.1 43.44,28.46 43.44,27.4 46.82,24.02 46.82,11.75 50.73,7.84 58.02,7.84 64.24,14.06 67.8,14.06 J5.2
PD4  (via drill 0.35)
  Top 0.203: v46.64,28.82 46.11,29.35 43.44,29.35 U4.2 | v52.33,23.13 54.28,23.13 60.69,16.73 63.53,16.73 | 63.53,16.73 67.8,16.73 J5.3 | IC1.14 20.15,27.75 19.26,26.86 13.57,26.86 v6.63,33.8 | 63.53,16.73 v63.53,18.69
  Bottom 0.203: v52.33,23.13 v46.64,28.82 | v6.63,33.8 6.63,43.76 6.46,43.93 6.46,45.53 13.03,52.11 39.17,52.11 66.55,24.73 66.55,21.71 v63.53,18.69
PD5  (via drill 0.35)
  Top 0.203: U4.9 42.02,35.58 43.62,35.58 50.91,28.29 50.91,27.58 v55.71,22.78 59.09,19.4 67.62,19.4 67.8,19.22 J5.4 | v24.06,26.15 24.06,28.11 IC1.11 | v29.39,20.82 29.39,16.2 v31.7,13.89
  Bottom 0.203: v29.39,20.82 v24.06,26.15 | v31.7,13.89 33.66,13.89 40.77,6.77 46.99,6.77 51.97,11.75 51.97,19.04 v55.71,22.78
PD6  (via drill 0.35)
  Top 0.203: v40.95,37 40.95,35.93 U4.10 | v64.77,24.38 67.26,21.89 67.8,21.89 J5.5 | v25.3,25.98 25.3,28.11 IC1.10
  Bottom 0.203: v40.95,37 40.95,43.22 39.7,44.47 39.7,47.85 40.59,48.73 41.48,48.73 62.11,28.11 | 62.11,28.11 64.77,25.44 v64.77,24.38 | v25.3,25.98 30.1,21.18 30.1,5.71 34.55,1.26 41.66,1.26 46.82,6.42 47.17,6.42 52.33,11.57 52.33,18.33 62.11,28.11
PD7  (via drill 0.35)
  Top 0.203: v38.1,37 39.7,37 40.24,36.47 40.24,35.93 U4.11 | v65.84,24.38 67.8,24.38 J5.6 | v21.04,30.95 22.64,29.35 22.64,28.29 IC1.12 | v22.81,34.87 v21.04,33.09
  Bottom 0.203: v65.84,24.38 65.84,24.91 41.66,49.09 38.46,49.09 37.22,47.85 37.22,44.29 38.1,43.4 v38.1,37 36.15,35.04 35.08,35.04 34.73,35.4 34.73,36.11 34.9,36.29 34.9,38.78 34.55,39.13 33.84,39.13 33.66,38.96 23.88,38.96 23.35,38.42 23.35,37.71 23.7,37.35 23.7,35.58 23.35,35.22 23.17,35.22 v22.81,34.87 | v21.04,33.09 v21.04,30.95
QA  (via drill 0.35)
  Top 0.203: v16.41,7.66 16.41,9.44 D1.A | v19.97,4.11 19.97,1.97 J1.1 | v17.66,14.6 17.66,17.97 470Ω.16 | v50.91,44.29 66.02,44.29 U$1.PIN7 | v43.26,49.62 19.61,49.62 16.77,46.78 16.77,43.22 16.06,42.51 v14.46,42.51
  Bottom 0.203: v19.97,4.11 v16.41,7.66 15.35,8.73 15.35,11.22 17.66,13.53 v17.66,14.6 17.66,15.31 13.39,19.57 13.39,40.91 14.46,41.98 v14.46,42.51 | v50.91,44.29 50.55,44.29 45.93,48.91 43.97,48.91 v43.26,49.62
QB  (via drill 0.35)
  Top 0.203: v18.37,7.66 18.37,9.44 D2.A | v20.86,3.57 20.86,2.15 21.04,1.97 J1.2 | v18.9,15.84 18.9,17.97 470Ω.15 | v31.88,41.98 40.95,41.98 43.08,44.11 43.08,45.71 45.22,47.85 49.13,47.85 51.8,50.51 67.8,50.51 68.15,50.16 68.15,43.22 66.73,41.8 66.2,41.8 U$1.PIN6 | v28.15,41.09 25.13,38.07 25.13,37.53 24.59,37 18.55,37 v18.19,36.64
  Bottom 0.203: v20.86,3.57 20.86,4.28 18.37,6.77 v18.37,7.66 15.7,10.33 15.7,11.04 18.9,14.24 v18.9,15.84 15.7,19.04 15.7,34.51 17.84,36.64 v18.19,36.64 | v31.88,41.98 29.04,41.98 v28.15,41.09
QC  (via drill 0.35)
  Top 0.203: 16.41,10.33 15.52,10.33 14.28,9.08 14.28,3.75 14.64,3.4 15.88,3.4 18.01,5.53 19.97,5.53 21.92,3.57 21.92,1.97 J1.3 | 16.41,10.33 19.08,10.33 19.97,9.44 D3.A | v19.61,15.13 20.15,15.66 20.15,17.97 470Ω.14 | 16.41,10.33 v16.41,10.68 v8.23,18.86 | v49.48,44.29 47.17,44.29 U$1.PIN4
  Bottom 0.203: v19.61,15.13 19.61,13.89 v16.41,10.68 | v49.48,44.29 47.53,44.29 39.35,52.47 12.86,52.47 5.92,45.53 5.92,21.18 v8.23,18.86
QD  (via drill 0.35)
  Top 0.203: v21.92,7.66 21.92,9.26 D4.A | v21.92,4.64 21.92,4.11 22.81,3.22 | 22.81,3.22 22.99,3.04 22.99,1.97 J1.4 | v22.1,14.6 21.57,15.13 21.57,17.97 470Ω.13 | v49.48,49.27 47.17,49.27 U$1.PIN2 | v44.51,50.69 44.51,50.16 44.33,49.98 44.33,48.02 42.37,46.07 42.37,44.47 40.59,42.69 33.66,42.69 32.95,43.4 v30.28,43.4 | v26.55,5 24.59,5 22.81,3.22
  Bottom 0.203: v21.92,4.64 v21.92,7.66 22.1,7.84 v22.1,14.6 | v49.48,49.27 45.93,49.27 v44.51,50.69 | v30.28,43.4 29.93,43.04 16.06,43.04 13.75,40.73 13.75,40.02 16.41,37.35 18.55,37.35 21.75,34.15 21.75,26.86 27.61,21 27.61,6.06 v26.55,5
QE  (via drill 0.35)
  Top 0.203: v23.88,7.48 23.88,9.26 D5.A | v23.88,3.22 23.88,2.15 24.06,1.97 J1.5 | v22.81,16.02 22.81,17.97 470Ω.12 | v13.39,51.4 14.1,52.11 44.15,52.11 44.33,51.93 46.99,51.93 U$1.PIN1
  Bottom 0.203: v22.81,16.02 22.81,8.55 v23.88,7.48 v23.88,3.22 23.53,2.86 20.15,2.86 15.7,7.31 15.7,7.66 14.99,8.37 14.99,10.15 12.5,12.64 12.5,38.6 8.95,42.16 8.77,42.16 6.81,44.11 6.81,44.82 v13.39,51.4
QF  (via drill 0.35)
  Top 0.203: v25.48,7.48 25.48,9.26 D6.A | v25.48,3.22 25.48,2.33 25.13,1.97 J1.6 | v23.35,23.66 23.35,20.29 24.06,19.57 24.06,18.15 470Ω.11 | v31.88,39.67 33.66,41.44 40.95,41.44 44.86,45.36 48.77,45.36 52.51,49.09 66.02,49.09 U$1.PIN9 | v27.79,39.67 24.77,36.64 19.44,36.64 v18.37,35.58
  Bottom 0.203: v25.48,3.22 v25.48,7.48 25.13,7.84 25.13,14.77 23.35,16.55 v23.35,23.66 16.06,30.95 16.06,34.33 17.3,35.58 v18.37,35.58 | v27.79,39.67 v31.88,39.67
QG  (via drill 0.35)
  Top 0.203: v26.9,7.48 27.26,7.84 27.26,9.26 D7.A | v26.19,3.93 26.19,1.97 J1.7 | v25.48,15.49 25.48,17.97 470Ω.10 | v32.59,42.69 32.95,42.33 40.77,42.33 42.73,44.29 42.73,45.89 44.68,47.85 44.68,49.8 45.39,50.51 48.77,50.51 50.02,51.76 66.02,51.76 U$1.PIN10 | v27.08,41.09 27.08,40.56 24.77,38.24 24.77,37.71 24.41,37.35 16.77,37.35 15.88,36.47 15.88,34.87 v16.77,33.98
  Bottom 0.203: v26.19,3.93 25.84,4.28 25.84,5.35 26.9,6.42 v26.9,7.48 25.48,8.91 v25.48,15.49 25.48,22.6 16.77,31.31 v16.77,33.98 | v32.59,42.69 28.68,42.69 v27.08,41.09
QH  (via drill 0.35)
  Top 0.203: 29.93,8.55 33.13,5.35 33.13,3.93 32.95,3.75 30.1,3.75 28.33,1.97 27.08,1.97 J1.8 | 29.93,8.55 29.21,9.26 D8.A | U$1.PIN5 46.99,41.62 43.44,38.07 35.26,38.07 33.66,36.47 28.15,36.47 27.79,36.11 27.79,34.87 26.55,33.62 25.48,33.62 23.88,32.02 23.88,31.67 23.35,31.13 23.35,25.8 25.84,23.31 25.84,21 26.55,20.29 26.55,18.15 470Ω.9 26.55,17.97 v29.39,15.13 | v29.39,8.02 29.93,8.55
  Bottom 0.203: v29.39,15.13 v29.39,8.02
RESET  (via drill 0.35)
  Top 0.203: 39.7,26.33 39.53,26.51 39.53,27.04 U4.29 | 39.7,26.33 42.37,23.66 42.37,21.71 41.48,20.82 41.48,19.57 R5.2 | v17.12,38.78 9.48,46.42 9.48,46.78 ISP.2 | v22.99,35.93 24.59,35.93 24.77,35.75 S1.B2 24.95,35.58 v26.19,34.33 | v39.35,25.98 39.7,26.33
  Bottom 0.203: v17.12,38.78 20.15,38.78 v22.99,35.93 | v39.35,25.98 35.44,25.98 27.08,34.33 v26.19,34.33
RESOUT  (via drill 0.35)
  Top 0.203: v8.59,37.35 8.59,34.87 9V/5V(B).B 8.77,34.69 10.19,33.27 18.72,33.27 19.61,32.38 21.39,32.38 21.57,32.55 v23.35,32.55 | v8.59,41.44 8.59,41.98 8.41,42.16 9V/5V(T).B | v35.62,21 35.62,19.22 IC4.3 | v32.95,27.04 31.88,27.04 v31.53,27.4 | v9.12,14.24 7.7,12.82 7.7,4.11 PDIOIDE.2
  Bottom 0.203: v8.59,41.44 v8.59,37.35 9.12,36.82 v9.12,14.24 | v35.62,21 35.62,24.38 v32.95,27.04 | v31.53,27.4 28.5,27.4 v23.35,32.55
RX  (via drill 0.35)
  Top 0.203: v44.68,22.06 40.24,26.51 40.24,27.04 U4.30 | v61.93,13 v52.86,22.06 | v67.26,7.66 67.26,6.77 J2.2
  Bottom 0.203: v52.86,22.06 v44.68,22.06 | v67.26,7.66 v61.93,13
SCK  (via drill 0.35)
  Top 0.203: v16.59,47.67 15.88,46.96 11.26,46.96 10.55,47.67 8.77,47.67 8.41,47.31 8.41,46.96 ISP.4 | v34.37,44.64 35.62,43.4 v39.17,43.4 | v39.53,34.15 35.08,34.15 34.9,34.33 U4.17
  Bottom 0.203: v16.59,47.67 31.35,47.67 v34.37,44.64 | v39.17,43.4 39.17,39.49 39.53,39.13 v39.53,34.15
SCL  (via drill 0.35)
  Top 0.203: v34.19,38.42 35.26,39.49 R3.1 35.44,39.67 36.33,40.56 37.75,40.56 37.93,40.38 v43.26,40.38 | v37.75,28.46 38.1,28.11 38.28,28.11 38.46,27.93 38.46,27.22 U4.28 38.64,27.04 38.64,25.62 v40.77,23.49 | v47.53,16.73 47.53,11.57 50.91,8.2 53.04,8.2 53.22,8.37 53.22,8.55 53.75,9.08 U2.6 | v45.93,39.49 67.8,39.49 J4.6
  Bottom 0.203: v34.19,38.42 34.19,32.02 v37.75,28.46 | v40.77,23.49 v47.53,16.73 | v45.93,39.49 44.15,39.49 v43.26,40.38
SDA  (via drill 0.35)
  Top 0.203: U4.27 37.93,27.22 37.93,25.8 39.7,24.02 39.7,22.42 R4.1 39.7,22.24 39.35,21.89 v39.35,21.35 | v49.66,11.93 52.51,11.93 54.46,9.97 54.46,9.8 55,9.26 U2.5 55.17,9.26 v56.06,10.15 | v67.8,35.58 67.8,36.82 J4.5
  Bottom 0.203: v49.66,11.93 40.24,21.35 v39.35,21.35 | v67.8,35.58 67.8,21.89 v56.06,10.15
TOPV  (via drill 0.35)
  Top 0.203: TOPHEADER+.2 40.95,44.82 38.64,44.82 TOPHEADER+.4 38.46,44.82 35.97,44.82 TOPHEADER+.6 | v7.52,44.47 7.52,42.33 9V/5V(T).C
  Bottom 0.203: v7.52,44.47 7.52,44.82 9.66,46.96 30.99,46.96 34.02,43.93 34.9,43.93 35.79,44.82 TOPHEADER+.6
TX
  Top 0.203: U4.31 41.13,27.22 41.13,27.93 41.31,28.11 42.19,28.11 46.46,23.84 46.46,11.57 52.68,5.35 66.55,5.35 67.26,4.64 J2.1
UNRESOUT
  Top 0.203: R2.1 32.42,3.04 32.77,3.04 33.48,3.75 33.48,6.6 29.04,11.04 17.12,11.04 13.92,14.24 13.92,16.2 9V+.1 13.75,16.37 13.75,25.62 11.97,27.4 9.66,27.4 8.59,26.33 4.68,26.33 ON||OFF|.1

### Text on the board
tNames: G. Benson ACES '19 | GND | Top Voltage (9V/5V) | Bottom Voltage (9V/5V) | 0.1uF | 10k | PC0 PC1 PC2 PC3 PC4 PC5 PC6 | VReg | GND 5V VIN | 555 | PD2 PD3 PD4 PD5 PD6 PD7 | GND | TX RX | 5V | A0 | QA QB QC QD QE QF QG QH
bNames: Colour: Value: / Black 0 / Brown 1 / Red 2 / Orange 3 / Yellow 4 / Green 5 / Blue 6 / Purple 7 / Grey 8 / White 9 | Marking: Value(uF): / 101 0.0001 / 102 0.001 / 103 0.01 / 104 0.1 / 221 0.00022 / 222 0.0022 / 223 0.022 / 224 0.22 / 331 0.00033 / 332 0.0033 / 333 0.033 / 334 0.33 / 471 0.00047 / 472 0.0047 / 473 0.047 / 474 0.47 | Resistor Markings: / Band #1 - First Digit / Band #2 - Second Digit / Band #3 - Multiplier (e.g. Red is 100x) / Band #4 - Tolerance (Brown = 1%, / Red = 2%, Gold = 5%, Silver = 10%)